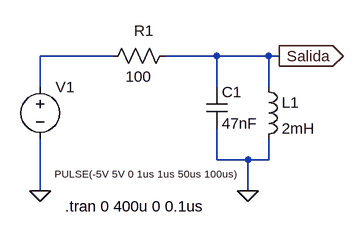
[diagram p0: schematic E2-RLC-mostrar-FFT.asc]
E2-RLC-mostrar-FFT.asc, the LTspice schematic file:
Version 4
SHEET 1 880 680
WIRE -240 -192 -352 -192
WIRE -80 -192 -160 -192
WIRE 0 -192 -80 -192
WIRE 16 -192 0 -192
WIRE -352 -144 -352 -192
WIRE -80 -144 -80 -192
WIRE 0 -144 0 -192
WIRE -80 -32 -80 -80
WIRE -32 -32 -80 -32
WIRE 0 -32 0 -64
WIRE 0 -32 -32 -32
WIRE -352 16 -352 -64
WIRE -32 16 -32 -32
FLAG -352 16 0
FLAG -32 16 0
FLAG 16 -192 Salida
IOPIN 16 -192 Out
SYMBOL voltage -352 -160 R0
WINDOW 3 22 150 Left 1
WINDOW 123 0 0 Left 0
WINDOW 39 0 0 Left 0
SYMATTR InstName V1
SYMATTR Value PULSE(-5V 5V 0 1us 1us 50us 100us)
SYMBOL res -144 -208 R90
WINDOW 0 -7 48 VBottom 2
WINDOW 3 32 56 VTop 2
SYMATTR InstName R1
SYMATTR Value 100
SYMBOL cap -96 -144 R0
SYMATTR InstName C1
SYMATTR Value 47nF
SYMBOL ind -16 -160 R0
SYMATTR InstName L1
SYMATTR Value 2mH
TEXT -314 40 Left 2 !.tran 0 400u 0 0.1us

The netlist it stands for:
* E2-RLC-mostrar-FFT.asc
V1 N001 0 PULSE(-5V 5V 0 1us 1us 50us 100us)
R1 Salida N001 100
C1 Salida 0 47nF
L1 Salida 0 2mH
.tran 0 400u 0 0.1us
.backanno
.end